# Altium project Kasli.PrjPCB (part 3 of 6)

## Sheet PowerSupplies.SchDoc: =ProjectName
size 420 x 297 mm; Author: Paweł Kulik; CompanyName: WUT; DrawnBy: Paweł Kulik; Organization: WUT ISE; Address1: Warsaw Univeristy of Technology; Address2: Nowowiejska 15/19; DocumentNumber: 4; Revision: 2.0.1; SheetNumber: 9; SheetTotal: 11; EDA_Number: ARTIQ; Projet: ARTIQ/SINARA; ModifiedBy: -; CheckedDate: -; Title2: PowerSupplies.SchDoc; DivGrp: ISE; Designer: Paweł Kulik; ModifiedDate: -; ProjectName: ARTIQ/SINARA
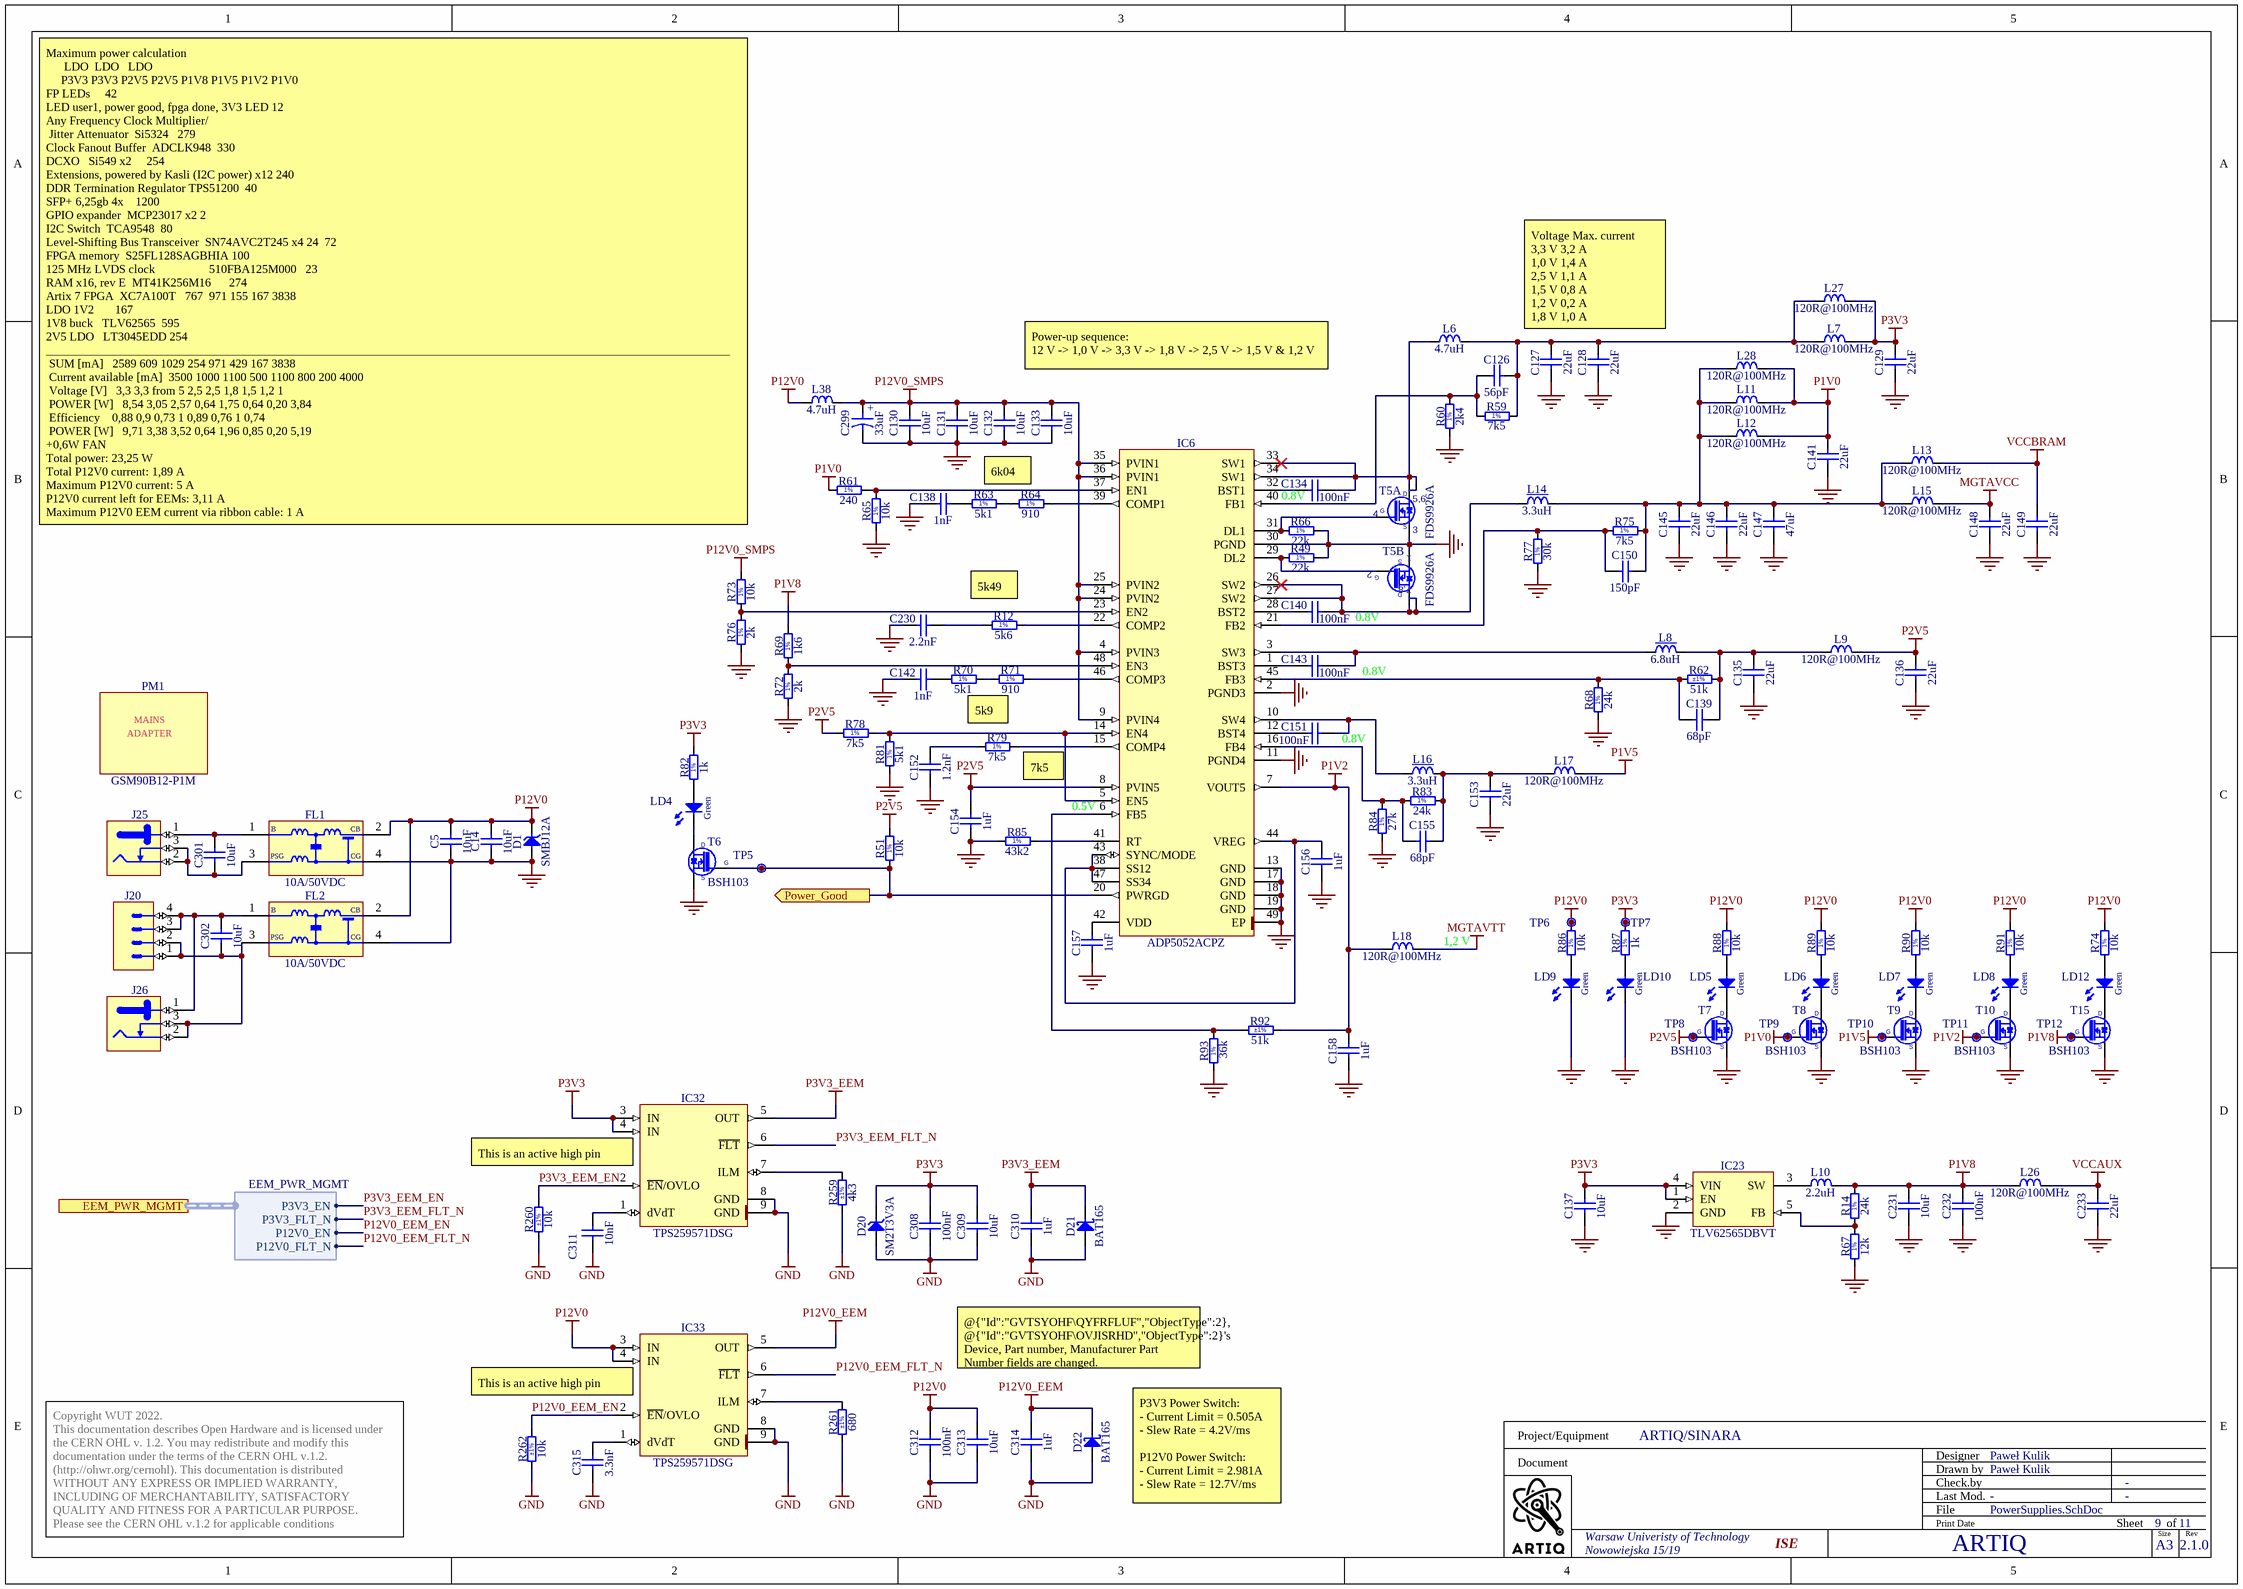
[diagram p3: PowerSupplies.SchDoc]

### Parts
C5  10uF  [CAPC2012X95N]
C14  10uF  [CAPC2012X95N]
C126  56pF  [CAPC1608X87N]
C127  22uF  [CAPC1709X100N]
C128  22uF  [CAPC1709X100N]
C129  22uF  [CAPC1709X100N]
C130  10uF  [CAPC2012X95N]
C131  10uF  [CAPC2012X95N]
C132  10uF  [CAPC2012X95N]
C133  10uF  [CAPC2012X95N]
C134  100nF  [CAPC0603X33N]
C135  22uF  [CAPC1709X100N]
C136  22uF  [CAPC1709X100N]
C137  10uF  [CAPC2012X95N]
C138  1nF  [CAPC1005X55N]
C139  68pF  [CAPC1005X55N]
C140  100nF  [CAPC0603X33N]
C141  22uF  [CAPC1709X100N]
C142  1nF  [CAPC1005X55N]
C143  100nF  [CAPC0603X33N]
C145  22uF  [CAPC1709X100N]
C146  22uF  [CAPC1709X100N]
C147  47uF  [CAPC3225X270N]
C148  22uF  [CAPC1709X100N]
C149  22uF  [CAPC1709X100N]
C150  150pF  [CAPC1005X55N]
C151  100nF  [CAPC0603X33N]
C152  1.2nF  [CAPC1608X87N]
C153  22uF  [CAPC1709X100N]
C154  1uF  [CAPC1005X55N]
C155  68pF  [CAPC1005X55N]
C156  1uF  [CAPC1005X55N]
C157  1uF  [CAPC1005X55N]
C158  1uF  [CAPC1005X55N]
C230  2.2nF  [CAPC1005X55N]
C231  10uF  [CAPC2012X95N]
C232  100nF  [CAPC0603X33N]
C233  22uF  [CAPC1709X100N]
C299  33uF  [CAPMP3528X210N]
C301  10uF  [CAPC2012X95N]
C302  10uF  [CAPC2012X95N]
C308  100nF  [CAPC1608X87N]
C309  10uF  [CAPC2012X95N]
C310  1uF  [CAPC1608X87N]
C311  10nF  [CAPC1005X55N]
C312  100nF  [CAPC1608X87N]
C313  10uF  [CAPC2012X95N]
C314  1uF  [CAPC1608X87N]
C315  3.3nF  [CAPC1005X55N]
D1  SMBJ12A  [DIOM5336X265N]
D20  SM2T3V3A  [DO-216AA]
D21  BAT165  [SOD2512X110N]
D22  BAT165  [SOD2512X110N]
FL1  10A/50VDC  [FIL_MURATA_BNX02]
FL2  10A/50VDC  [FIL_MURATA_BNX02]
IC6  ADP5052ACPZ  [QFN50P700X700X80-49N-S570]
IC23  TLV62565DBVT  [SOT95P280X145-5N]
IC32  TPS259571DSG  [SON50P200X200X80-9N-R100X170]
IC33  TPS259571DSG  [SON50P200X200X80-9N-R100X170]
J20  Mini-Fit Jr.™  [MOLEX_39-30-0040]  (value not drawn)
J25  Jack  [SWITCHCRAFT_712RA]  (value not drawn)
J26  Jack  [SWITCHCRAFT_712RA]  (value not drawn)
L6  4.7uH  [IND_COOPER_DR74]
L7  120R@100MHz  [INDC1608X65N]
L8  6.8uH  [IND_COILCRAFT_XAL4030]
L9  120R@100MHz  [INDC1608X65N]
L10  2.2uH  [IND_WURTH_WE-PMCI_0806LR]
L11  120R@100MHz  [INDC1608X65N]
L12  120R@100MHz  [INDC1608X65N]
L13  120R@100MHz  [INDC1608X65N]
L14  3.3uH  [INDM5552X200N]
L15  120R@100MHz  [INDC1608X65N]
L16  3.3uH  [IND_WURTH_WE-PD3_S]
L17  120R@100MHz  [INDC1608X65N]
L18  120R@100MHz  [INDC1608X65N]
L26  120R@100MHz  [INDC1608X65N]
L27  120R@100MHz  [INDC1608X65N]
L28  120R@100MHz  [INDC1608X65N]
L38  4.7uH  [IND_COOPER_DR74]
LD4  Green  [LED_KINGBRIGHT_KPH-1608CGCK]
LD5  Green  [LED_KINGBRIGHT_KPH-1608CGCK]
LD6  Green  [LED_KINGBRIGHT_KPH-1608CGCK]
LD7  Green  [LED_KINGBRIGHT_KPH-1608CGCK]
LD8  Green  [LED_KINGBRIGHT_KPH-1608CGCK]
LD9  Green  [LED_KINGBRIGHT_KPH-1608CGCK]
LD10  Green  [LED_KINGBRIGHT_KPH-1608CGCK]
LD12  Green  [LED_KINGBRIGHT_KPH-1608CGCK]
PM1  GSM90B12-P1M  (mechanical)
R12  5k6  [RESC1005X40N]
R14  24k  [RESC1005X40N]
R49  22k  [RESC1005X40N]
R51  10k  [RESC1005X40N]
R59  7k5  [RESC1005X40N]
R60  2k4  [RESC1005X40N]
R61  240  [RESC1005X40N]
R62  51k  Tolerance: ±1%  [RESC1005X40N]
R63  5k1  [RESC1005X40N]
R64  910  [RESC1005X40N]
R65  10k  [RESC1005X40N]
R66  22k  [RESC1005X40N]
R67  12k  [RESC1005X40N]
R68  24k  [RESC1005X40N]
R69  1k6  [RESC1005X40N]
R70  5k1  [RESC1005X40N]
R71  910  [RESC1005X40N]
R72  2k  [RESC1005X40N]
R73  10k  [RESC1005X40N]
R74  10k  [RESC1005X40N]
R75  7k5  [RESC1005X40N]
R76  2k  [RESC1005X40N]
R77  30k  [RESC1005X40N]
R78  7k5  [RESC1005X40N]
R79  7k5  [RESC1005X40N]
R81  5k1  [RESC1005X40N]
R82  1k  [RESC1005X40N]
R83  24k  [RESC1005X40N]
R84  27k  [RESC1005X40N]
R85  43k2  [RESC1005X35N]
R86  10k  [RESC1005X40N]
R87  1k  [RESC1005X40N]
R88  10k  [RESC1005X40N]
R89  10k  [RESC1005X40N]
R90  10k  [RESC1005X40N]
R91  10k  [RESC1005X40N]
R92  51k  Tolerance: ±1%  [RESC1005X40N]
R93  36k  [RESC1005X40N]
R259  4k3  Tolerance: ±1%  [RESC1005X40N]
R260  10k  Tolerance: ±1%  [RESC1005X40N]
R261  680  Tolerance: ±1%  [RESC1005X40N]
R262  10k  Tolerance: ±1%  [RESC1005X40N]
T5  FDS9926A  [SOIC127P600X175-8N]  (parts A,B of 2)
T6  BSH103  [SOT95P230X110-3N]
T7  BSH103  [SOT95P230X110-3N]
T8  BSH103  [SOT95P230X110-3N]
T9  BSH103  [SOT95P230X110-3N]
T10  BSH103  [SOT95P230X110-3N]
T15  BSH103  [SOT95P230X110-3N]
TP5  Power Good  [TPS127]  (value not drawn)
TP6  P12V0  [TPS127]  (value not drawn)
TP7  P3V3  [TPS127]  (value not drawn)
TP8  P2V5  [TPS127]  (value not drawn)
TP9  P1V0  [TPS127]  (value not drawn)
TP10  P1V5  [TPS127]  (value not drawn)
TP11  P1V2  [TPS127]  (value not drawn)
TP12  P1V8  [TPS127]  (value not drawn)

### Ports
EEM_PWR_MGMT (harness EEM_PWR_MGMT), Power_Good (out)

### Harnesses
EEM_PWR_MGMT: P3V3_EN, P12V0_EN, P3V3_FLT_N, P12V0_FLT_N

### Nets
GND: C5.1 C14.1 C127.1 C128.1 C129.1 C130.1 C131.1 C132.1 C133.1 C135.1 C136.1 C137.1 C138.1 C141.1 C142.1 C145.1 C146.1 C147.1 C148.1 C149.1 C152.1 C153.1 C154.1 C156.1 C157.1 C158.1 C230.1 C231.1 C232.1 C233.1 C299.2 C308.1 C309.1 C310.1 C311.1 C312.1 C313.1 C314.1 C315.1 D1.2(A) D20.2(A) D21.2(A) D22.2(A) FL1.4(CG) FL2.4(CG) IC6.2(PGND3) IC6.11(PGND4) IC6.13(GND) IC6.17(GND) IC6.18(GND) IC6.19(GND) IC6.30(PGND) IC6.49(EP) IC23.2(GND) IC32.8(GND) IC32.9(GND) IC33.8(GND) IC33.9(GND) LD9.1(C) LD10.1(C) R49.2 R60.1 R65.1 R66.2 R67.1 R68.1 R72.1 R76.1 R77.1 R81.1 R84.1 R85.1 R93.1 R259.1 R260.1 R261.1 R262.1 T5.1(S) T5.3(S) T6.2(S) T7.2(S) T8.2(S) T9.2(S) T10.2(S) T15.2(S)
MGTAVCC: C148.2 L15.2
MGTAVTT: L18.2
P1V0: C141.2 L11.2 L12.2 L28.2 R61.1 T8.1(G) TP9.1
P1V2: C158.2 IC6.7(VOUT5) L18.1 R92.2 T10.1(G) TP11.1
P1V5: L17.2 T9.1(G) TP10.1
P1V8: C231.2 C232.2 L10.2 L26.1 R14.2 R69.2 T15.1(G) TP12.1
P2V5: C136.2 C154.2 IC6.8(PVIN5) L9.2 R51.2 R78.1 T7.1(G) TP8.1
P3V3: C129.2 C137.2 C308.2 C309.2 D20.1(C) IC23.1(EN) IC23.4(VIN) IC32.3(IN) IC32.4(IN) L7.2 L27.2 R82.2 R87.2 TP7.1
P3V3_EEM: C310.2 D21.1(C) IC32.5(OUT)
P12V0: C5.2 C14.2 C312.2 C313.2 D1.1(C) FL1.2(CB) FL2.2(CB) IC33.3(IN) IC33.4(IN) L38.1 R74.2 R86.2 R88.2 R89.2 R90.2 R91.2 TP6.1
P12V0_EEM: C314.2 D22.1(C) IC33.5(OUT)
P12V0_SMPS: C130.2 C131.2 C132.2 C133.2 C299.1 IC6.4(PVIN3) IC6.9(PVIN4) IC6.24(PVIN2) IC6.25(PVIN2) IC6.35(PVIN1) IC6.36(PVIN1) L38.2 R73.2
VCCAUX: C233.2 L26.2
VCCBRAM: C149.2 L13.2
P3V3_EEM_EN: IC32.2(~{EN}/OVLO) R260.2 ; port EEM_PWR_MGMT.P3V3_EN
P3V3_EEM_FLT_N: IC32.6(~{FLT}) ; port EEM_PWR_MGMT.P3V3_FLT_N
P12V0_EEM_EN: IC33.2(~{EN}/OVLO) R262.2 ; port EEM_PWR_MGMT.P12V0_EN  [project net EEM_PWR_EN]
P12V0_EEM_FLT_N: IC33.6(~{FLT}) ; port EEM_PWR_MGMT.P12V0_FLT_N  [project net EEM_FLT_N]
RESETn: IC6.20(PWRGD) R51.1 T6.1(G) TP5.1 ; port Power_Good
NetC126_1: C126.1 IC6.40(FB1) R59.1 R60.2
NetC126_2: C126.2 C127.2 C128.2 L6.2 L7.1 L27.1 R59.2
NetC134_1: C134.1 IC6.33(SW1) IC6.34(SW1) L6.1 T5.5(D) T5.6(D)
NetC134_2: C134.2 IC6.32(BST1)
NetC135_2: C135.2 C139.2 L8.2 L9.1 R62.2
NetC138_2: C138.2 R63.1
NetC139_1: C139.1 IC6.45(FB3) R62.1 R68.2
NetC140_1: C140.1 IC6.26(SW2) IC6.27(SW2) L14.1 T5.7(D) T5.8(D)
NetC140_2: C140.2 IC6.28(BST2)
NetC142_2: C142.2 R70.1
NetC143_1: C143.1 IC6.3(SW3) L8.1
NetC143_2: C143.2 IC6.1(BST3)
NetC145_2: C145.2 C146.2 C147.2 C150.2 L11.1 L12.1 L13.1 L14.2 L15.1 L28.1 R75.2
NetC150_1: C150.1 IC6.21(FB2) R75.1 R77.2
NetC151_1: C151.1 IC6.10(SW4) L16.1
NetC151_2: C151.2 IC6.12(BST4)
NetC152_2: C152.2 R79.1
NetC153_2: C153.2 C155.2 L16.2 L17.1 R83.2
NetC155_1: C155.1 IC6.16(FB4) R83.1 R84.2
NetC156_2: C156.2 IC6.38(SS12) IC6.43(SYNC/MODE) IC6.44(VREG) IC6.47(SS34)
NetC157_2: C157.2 IC6.42(VDD)
NetC230_2: C230.2 R12.1
NetC301_1: C301.1 FL1.3(PSG) J25.2 J25.3
NetC301_2: C301.2 FL1.1(B) J25.1
NetC302_1: C302.1 FL2.3(PSG) J20.1 J20.2 J26.2 J26.3
NetC302_2: C302.2 FL2.1(B) J20.3 J20.4 J26.1
NetC311_2: C311.2 IC32.1(dVdT)
NetC315_2: C315.2 IC33.1(dVdT)
NetIC6_5: IC6.5(EN5) IC6.14(EN4) R78.2 R81.2
NetIC6_6: IC6.6(FB5) R92.1 R93.2
NetIC6_15: IC6.15(COMP4) R79.2
NetIC6_22: IC6.22(COMP2) R12.2
NetIC6_23: IC6.23(EN2) R73.1 R76.2
NetIC6_29: IC6.29(DL2) R49.1 T5.2(G)
NetIC6_31: IC6.31(DL1) R66.1 T5.4(G)
NetIC6_37: IC6.37(EN1) R61.2 R65.2
NetIC6_39: IC6.39(COMP1) R64.2
NetIC6_41: IC6.41(RT) R85.2
NetIC6_46: IC6.46(COMP3) R71.2
NetIC6_48: IC6.48(EN3) R69.1 R72.2
NetIC23_3: IC23.3(SW) L10.1
NetIC23_5: IC23.5(FB) R14.1 R67.2
NetIC32_7: IC32.7(ILM) R259.2
NetIC33_7: IC33.7(ILM) R261.2
NetLD4_1: LD4.1(C) T6.3(D)
NetLD4_2: LD4.2(A) R82.1
NetLD5_1: LD5.1(C) T7.3(D)
NetLD5_2: LD5.2(A) R88.1
NetLD6_1: LD6.1(C) T8.3(D)
NetLD6_2: LD6.2(A) R89.1
NetLD7_1: LD7.1(C) T9.3(D)
NetLD7_2: LD7.2(A) R90.1
NetLD8_1: LD8.1(C) T10.3(D)
NetLD8_2: LD8.2(A) R91.1
NetLD9_2: LD9.2(A) R86.1
NetLD10_2: LD10.2(A) R87.1
NetLD12_1: LD12.1(C) T15.3(D)
NetLD12_2: LD12.2(A) R74.1
NetR63_2: R63.2 R64.1
NetR70_2: R70.2 R71.1

### Notes on the sheet
- Voltage	Max. current
  3,3 V	3,2 A
  1,0 V	1,4 A
  2,5 V	1,1 A
  1,5 V	0,8 A
  1,2 V	0,2 A
  1,8 V	1,0 A
- Power-up sequence:
  12 V -> 1,0 V -> 3,3 V -> 1,8 V -> 2,5 V -> 1,5 V & 1,2 V
- Maximum power calculation
  LDO		LDO			LDO
  P3V3	P3V3	P2V5	P2V5	P1V8	P1V5	P1V2	P1V0
  FP LEDs					42
  LED user1, power good, fpga done, 3V3 LED	12
  Any Frequency Clock Multiplier/
  Jitter Attenuator 	Si5324			279
  Clock Fanout Buffer		ADCLK948		330
  DCXO			Si549 x2					254
  Extensions, powered by Kasli (I2C power) x12	240
  DDR Termination Regulator	TPS51200		40
  SFP+ 6,25gb 4x				1200
  GPIO expander		MCP23017 x2	2
  I2C Switch		TCA9548		80
  Level-Shifting Bus Transceiver 	SN74AVC2T245 x4	24		72
  FPGA memory		S25FL128SAGBHIA	100
  125 MHz LVDS clock                  510FBA125M000			23
  RAM x16, rev E		MT41K256M16						274
  Artix 7 FPGA		XC7A100T			767		971	155	167	3838
  LDO 1V2							167
  1V8 buck			TLV62565		595
  2V5 LDO			LT3045EDD	254
  __________________________________________________________________________________________________________________
  SUM [mA]			2589	609	1029	254	971	429	167	3838
  Current available [mA]		3500	1000	1100	500	1100	800	200	4000
  Voltage [V]			3,3	3,3 from 5	2,5	2,5	1,8	1,5	1,2	1
  POWER [W]			8,54	3,05	2,57	0,64	1,75	0,64	0,20	3,84
  Efficiency				0,88	0,9	0,73	1	0,89	0,76	1	0,74
  POWER [W]			9,71	3,38	3,52	0,64	1,96	0,85	0,20	5,19
  +0,6W FAN
  Total power: 23,25 W
  Total P12V0 current: 1,89 A
  Maximum P12V0 current: 5 A
  P12V0 current left for EEMs: 3,11 A
  Maximum P12V0 EEM current via ribbon cable: 1 A
- 6k04
- (near C134) 0.8V
- (near R12) 5k49
- (near T5) 0.8V
- 5k9
- (near C143) 0.8V
- (near R79) 7k5
- (near C151) 0.8V
- (near IC6) 0.5V
- (near L18) 1,2 V
- (near IC32) This is an active high pin
- (near IC33) This is an active high pin
- @{"Id":"GVTSYOHF\QYFRFLUF","ObjectType":2}, @{"Id":"GVTSYOHF\OVJISRHD","ObjectType":2}'s Device, Part number, Manufacturer Part Number fields are changed.
  This symbol needs updating.
- (near D22) P3V3 Power Switch:
  - Current Limit = 0.505A
  - Slew Rate = 4.2V/ms
  P12V0 Power Switch:
  - Current Limit = 2.981A
  - Slew Rate = 12.7V/ms
- Project/Equipment
- Document
- Designer
- Drawn by
- Check.by
- Copyright WUT 2022.
  This documentation describes Open Hardware and is licensed under the CERN OHL v. 1.2. You may redistribute and modify this documentation under the terms of the CERN OHL v.1.2. (http://ohwr.org/cernohl). This documentation is distributed WITHOUT ANY EXPRESS OR IMPLIED WARRANTY, INCLUDING OF MERCHANTABILITY, SATISFACTORY QUALITY AND FITNESS FOR A PARTICULAR PURPOSE. Please see the CERN OHL v.1.2 for applicable conditions
- File
- Last Mod.
- Print Date
- Sheet
- Size
- A3
- of
- Rev
- (in symbol 43k2 1% 0402) 1%
- (in symbol CTE3528-21_33UF_16V_10%) +
- (in symbol DC_DC_GSM90B12-P1M) MAINS; ADAPTER
- (in symbol FDS9926A, part A) 5,6
- (in symbol FDS9926A, part B) 7,8
- (in symbol R0402_1K6_1%_0.0625W_100PPM) 1%
- (in symbol R0402_1k_1%_0.0625W_100PPM) 1%
- (in symbol R0402_2K4_1%_0.0625W_100PPM) 1%
- (in symbol R0402_2K_1%_0.0625W_100PPM) 1%
- (in symbol R0402_5K1_1%_0.0625W_100PPM) 1%
- (in symbol R0402_5K6_1%_0.0625W_100PPM) 1%
- (in symbol R0402_7K5_1%_0.0625W_100PPM) 1%
- (in symbol R0402_10K_1%_0.0625W_100PPM) 1%
- (in symbol R0402_10k_1%_0.0625W_100PPM) 1%
- (in symbol R0402_12K_1%_0.0625W_100PPM) 1%
- (in symbol R0402_22K_1%_0.0625W_100PPM) 1%
- (in symbol R0402_24K_1%_0.0625W_100PPM) 1%
- (in symbol R0402_27K_1%_0.0625W_100PPM) 1%
- (in symbol R0402_30K_1%_0.0625W_100PPM) 1%
- (in symbol R0402_36K_1%_0.0625W_100PPM) 1%
- (in symbol R0402_240R_1%_0.0625W_100PPM) 1%
- (in symbol R0402_910R_1%_0.0625W_100PPM) 1%

### Library data of the parts
C5 C14 C130-C133 C137 C231 C301 C302 C309 C313 = CC0805_10UF_25V_10%_X5R: Non-polarised capacitor; Part Description: SMD Multilayer Chip Ceramic Capacitor; Manufacturer: GENERIC; Manufacturer1 Part Number: GRM219R61E106KA12D; Voltage: 25V; TC: X5R; Tolerance: ±10%; Part Number: CC0805_10UF_25V_10%_X5R; Component Kind: Standard; Component Type: Standard; Pin Count: 2; Value: 10uF; Status: Preferred; Manufacturer Part Number: CC0805_10UF_25V_10%_X5R; Case: 0805; Mounted: Yes; Socket: No; SMD: Yes; Sense: No; Manufacturer1 Example: MURATA; Manufacturer1 ComponentHeight: 0.95mm; HelpURL: \\cern.ch\dfs\Applications\Altium\Datasheets\CC0805_X5R_MURATA_GRM.pdf; Author: CERN DEM JLC
  C5 C14 C137 C231 C301 C302 C309 C313: CreateDate: 25.10.2012; LatestRevisionDate: 06.09.2016
  C130-C133: CreateDate: 2012-10-25; LatestRevisionDate: 2016-09-06
C126 = CC0603_56PF_50V_5%_NP0: Non-polarised capacitor; Part Description: SMD Multilayer Chip Ceramic Capacitor; Manufacturer: GENERIC; Manufacturer1 Part Number: 223886715569; Voltage: 50V; TC: C0G/NP0; Tolerance: ±5%; Part Number: CC0603_56PF_50V_5%_NP0; Component Kind: Standard; Component Type: Standard; Pin Count: 2; Value: 56pF; Status: Preferred; Manufacturer Part Number: CC0603_56PF_50V_5%_NP0; Case: 0603; Mounted: Yes; Socket: No; SMD: Yes; Sense: No; Manufacturer1 Example: PHYCOMP; Manufacturer1 ComponentHeight: 0.87mm; HelpURL: \\cern.ch\dfs\Applications\Altium\Datasheets\CC0603_NP0_PHYCOMP.pdf; Author: CERN DEM JLC; CreateDate: 03.12.2007; LatestRevisionDate: 03.12.2007
C127-C129 C135 C136 C141 C145 C146 C148 C149 C153 C233 = CC0603_22UF_6.3V_20%_X5R: Non-polarised capacitor; Part Description: SMD Multilayer Chip Ceramic Capacitor; Manufacturer: GENERIC; Manufacturer1 Part Number: C1608X5R0J226M080AC; Voltage: 6.3V; TC: X5R; Tolerance: ±20%; Part Number: CC0603_22UF_6.3V_20%_X5R; Component Kind: Standard; Component Type: Standard; Pin Count: 2; Value: 22uF; Status: None; Manufacturer Part Number: CC0603_22UF_6.3V_20%_X5R; Case: 0603; Mounted: Yes; Socket: No; SMD: Yes; Sense: No; Manufacturer1 Example: TDK; Manufacturer1 ComponentHeight: 1mm; HelpURL: \\cern.ch\dfs\Applications\Altium\Datasheets\CC0603_X5R_TDK_C.pdf; Author: CERN DEM JLC; CreateDate: 16.12.2013; LatestRevisionDate: 13.09.2016
C134 C140 C143 C151 C232 = CC0201_100NF_6.3V_10%_X5R: Non-polarised capacitor; Part Description: SMD Multilayer Chip Ceramic Capacitor; Manufacturer: GENERIC; Manufacturer1 Part Number: 02016D104KAT2A; Voltage: 6.3V; TC: X5R; Tolerance: ±10%; Part Number: CC0201_100NF_6.3V_10%_X5R; Component Kind: Standard; Component Type: Standard; Pin Count: 2; Value: 100nF; Status: Not Recommended; Manufacturer Part Number: CC0201_100NF_6.3V_10%_X5R; Case: 0201; Mounted: Yes; Socket: No; SMD: Yes; Sense: No; Manufacturer1 Example: AVX; Manufacturer1 ComponentHeight: 0.33mm; HelpURL: \\cern.ch\dfs\Applications\Altium\Datasheets\CC0201_X5R_AVX.pdf; Author: CERN DEM JLC
  C134 C140 C143 C151: CreateDate: 2007-12-03; LatestRevisionDate: 2007-12-03
  C232: CreateDate: 03.12.2007; LatestRevisionDate: 03.12.2007
C138 C142 = CC0402_1NF_50V_10%_X7R: Non-polarised capacitor; Part Description: SMD Multilayer Chip Ceramic Capacitor; Manufacturer: GENERIC; Manufacturer1 Part Number: 223858715623; Voltage: 50V; TC: X7R; Tolerance: ±10%; Part Number: CC0402_1NF_50V_10%_X7R; Component Kind: Standard; Component Type: Standard; Pin Count: 2; Value: 1nF; Status: Not Recommended; Manufacturer Part Number: CC0402_1NF_50V_10%_X7R; Case: 0402; Mounted: Yes; Socket: No; SMD: Yes; Sense: No; Manufacturer1 Example: PHYCOMP; Manufacturer1 ComponentHeight: 0.55mm; HelpURL: \\cern.ch\dfs\Applications\Altium\Datasheets\CC0402_X7R_PHYCOMP.pdf; Author: CERN DEM JLC; CreateDate: 03.12.2007; LatestRevisionDate: 03.12.2007
C139 C155 = CC0402_68PF_50V_5%_C0G: Non-polarised capacitor; Part Description: SMD Multilayer Chip Ceramic Capacitor; Manufacturer: GENERIC; Manufacturer1 Part Number: C0402C680J5GACTU; Voltage: 50V; TC: C0G/NP0; Tolerance: ±5%; Part Number: CC0402_68PF_50V_5%_C0G; Component Kind: Standard; Component Type: Standard; Pin Count: 2; Value: 68pF; Status: Preferred; Manufacturer Part Number: CC0402_68PF_50V_5%_C0G; Case: 0402; Mounted: Yes; Socket: No; SMD: Yes; Sense: No; Manufacturer1 Example: KEMET; Manufacturer1 ComponentHeight: 0.55mm; HelpURL: \\cern.ch\dfs\Applications\Altium\Datasheets\CC0805_C0G_KEMET_(Commercial Grade).pdf; Author: CERN DEM JLC; CreateDate: 03.12.2007; LatestRevisionDate: 22.04.2015
C147 = CC1210_47UF_10V_10%_X7R: Non-polarised capacitor; Part Description: SMD Multilayer Chip Ceramic Capacitor; Manufacturer: GENERIC; Manufacturer1 Part Number: GRM32ER71A476KE15; Voltage: 10V; TC: X7R; Tolerance: ±10%; Part Number: CC1210_47UF_10V_10%_X7R; Component Kind: Standard; Component Type: Standard; Pin Count: 2; Value: 47uF; Status: None; Manufacturer Part Number: CC1210_47UF_10V_10%_X7R; Case: 1210; Mounted: Yes; Socket: No; SMD: Yes; Sense: No; Manufacturer1 Example: MURATA; Manufacturer1 ComponentHeight: 2.7mm; HelpURL: \\cern.ch\dfs\Applications\Altium\Datasheets\CC1210_X7R_MURATA.pdf; Author: CERN DEM BC; CreateDate: 18.11.2015; LatestRevisionDate: 18.11.2015
C150 = CC0402_150PF_50V_5%_C0G: Non-polarised capacitor; Part Description: SMD Multilayer Chip Ceramic Capacitor; Manufacturer: GENERIC; Manufacturer1 Part Number: C0402C151J5GACTU; Voltage: 50V; TC: C0G/NP0; Tolerance: ±5%; Part Number: CC0402_150PF_50V_5%_C0G; Component Kind: Standard; Component Type: Standard; Pin Count: 2; Value: 150pF; Status: Preferred; Manufacturer Part Number: CC0402_150PF_50V_5%_C0G; Case: 0402; Mounted: Yes; Socket: No; SMD: Yes; Sense: No; Manufacturer1 Example: KEMET; Manufacturer1 ComponentHeight: 0.55mm; HelpURL: \\cern.ch\dfs\Applications\Altium\Datasheets\CC0805_C0G_KEMET_(Commercial Grade).pdf; Author: CERN DEM JLC; CreateDate: 03.12.2007; LatestRevisionDate: 22.04.2015
C152 = CC0603_1.2NF_50V_10%_X7R: Non-polarised capacitor; Part Description: SMD Multilayer Chip Ceramic Capacitor; Manufacturer: GENERIC; Manufacturer1 Part Number: 223858615624; Voltage: 50V; TC: X7R; Tolerance: ±10%; Part Number: CC0603_1.2NF_50V_10%_X7R; Component Kind: Standard; Component Type: Standard; Pin Count: 2; Value: 1.2nF; Status: Preferred; Manufacturer Part Number: CC0603_1.2NF_50V_10%_X7R; Case: 0603; Mounted: Yes; Socket: No; SMD: Yes; Sense: No; Manufacturer1 Example: PHYCOMP; Manufacturer1 ComponentHeight: 0.87mm; HelpURL: \\cern.ch\dfs\Applications\Altium\Datasheets\CC0603_X7R_PHYCOMP.pdf; Author: CERN DEM JLC; CreateDate: 03.12.2007; LatestRevisionDate: 03.12.2007
C154 C156-C158 = CC0402_1UF_16V_10%_X5R: Non-polarised capacitor; Part Description: SMD Multilayer Chip Ceramic Capacitor; Manufacturer: GENERIC; Manufacturer1 Part Number: C1005X5R1C105KT; Voltage: 16V; TC: X5R; Tolerance: ±10%; Part Number: CC0402_1UF_16V_10%_X5R; Component Kind: Standard; Component Type: Standard; Pin Count: 2; Value: 1uF; Status: Preferred; Manufacturer Part Number: CC0402_1UF_16V_10%_X5R; Case: 0402; Mounted: Yes; Socket: No; SMD: Yes; Sense: No; Manufacturer1 Example: TDK; Manufacturer1 ComponentHeight: 0.55mm; HelpURL: \\cern.ch\dfs\Applications\Altium\Datasheets\CC0402_X5R_TDK_C.pdf; Author: CERN DEM JLC; CreateDate: 2012-10-25; LatestRevisionDate: 2012-10-25
C230 = CC0402_2.2NF_50V_10%_X7R: Non-polarised capacitor; Part Description: SMD Multilayer Chip Ceramic Capacitor; Manufacturer: GENERIC; Manufacturer1 Part Number: 223858715627; Voltage: 50V; TC: X7R; Tolerance: ±10%; Part Number: CC0402_2.2NF_50V_10%_X7R; Component Kind: Standard; Component Type: Standard; Pin Count: 2; Value: 2.2nF; Status: Not Recommended; Manufacturer Part Number: CC0402_2.2NF_50V_10%_X7R; Case: 0402; Mounted: Yes; Socket: No; SMD: Yes; Sense: No; Manufacturer1 Example: PHYCOMP; Manufacturer1 ComponentHeight: 0.55mm; HelpURL: \\cern.ch\dfs\Applications\Altium\Datasheets\CC0402_X7R_PHYCOMP.pdf; Author: CERN DEM JLC; CreateDate: 03.12.2007; LatestRevisionDate: 03.12.2007
C299 = CTE3528-21_33UF_16V_10%: Polarised capacitor; Part Description: Solid Tantalum Chip Capacitor; Manufacturer: GENERIC; Manufacturer1 Part Number: TAJB336K016R; Voltage: 16V; Tolerance: ±10%; Part Number: CTE3528-21_33UF_16V_10%; Component Kind: Standard; Component Type: Standard; Pin Count: 2; Value: 33uF; Status: Preferred; Manufacturer Part Number: CTE3528-21_33UF_16V_10%; Case: B; Mounted: Yes; Socket: No; SMD: Yes; Sense: No; HelpURL: \\cern.ch\dfs\Applications\Altium\Datasheets\CTE_AVX_TAJ.pdf; Author: CERN DEM JLC; CreateDate: 03.12.2007; LatestRevisionDate: 03.12.2007; Manufacturer1 Example: AVX; Manufacturer1 ComponentHeight: 2.1mm
C308 C312 = CC0603_100NF_50V_10%_X7R: Non-polarised capacitor; Part Description: SMD Multilayer Chip Ceramic Capacitor; Manufacturer: GENERIC; Manufacturer1 Part Number: 223858615649; Voltage: 50V; TC: X7R; Tolerance: ±10%; Part Number: CC0603_100NF_50V_10%_X7R; Component Kind: Standard; Component Type: Standard; Pin Count: 2; Value: 100nF; Status: Preferred; Manufacturer Part Number: CC0603_100NF_50V_10%_X7R; Case: 0603; Mounted: Yes; Socket: No; SMD: Yes; Sense: No; Manufacturer1 Example: PHYCOMP; Manufacturer1 ComponentHeight: 0.87mm; HelpURL: \\cern.ch\dfs\Applications\Altium\Datasheets\CC0603_X7R_PHYCOMP.pdf; Author: CERN DEM JLC; CreateDate: 12/3/2007; LatestRevisionDate: 12/3/2007
C310 C314 = CC0603_1UF_16V_10%_X7R: Non-polarised capacitor; Part Description: SMD Multilayer Chip Ceramic Capacitor; Manufacturer: GENERIC; Manufacturer1 Part Number: 223878615663; Voltage: 16V; TC: X7R; Tolerance: ±10%; Part Number: CC0603_1UF_16V_10%_X7R; Component Kind: Standard; Component Type: Standard; Pin Count: 2; Value: 1uF; Status: None; Manufacturer Part Number: CC0603_1UF_16V_10%_X7R; Case: 0603; Mounted: Yes; Socket: No; SMD: Yes; Sense: No; Manufacturer1 Example: YAGEO PHYCOMP; Manufacturer1 ComponentHeight: 0.9mm; HelpURL: \\cern.ch\dfs\Applications\Altium\Datasheets\CC0603_X7R_PHYCOMP.pdf; Author: CERN DEM JLC; CreateDate: 12/3/2007; LatestRevisionDate: 4/17/2015
C311 = CC0402_10NF_16V_10%_X7R: Non-polarised capacitor; Part Description: SMD Multilayer Chip Ceramic Capacitor; Manufacturer: GENERIC; Manufacturer1 Part Number: 223878715636; Voltage: 16V; TC: X7R; Tolerance: ±10%; Part Number: CC0402_10NF_16V_10%_X7R; Component Kind: Standard; Component Type: Standard; Pin Count: 2; Value: 10nF; Status: Not Recommended; Manufacturer Part Number: CC0402_10NF_16V_10%_X7R; Case: 0402; Mounted: Yes; Socket: No; SMD: Yes; Sense: No; Manufacturer1 Example: PHYCOMP; Manufacturer1 ComponentHeight: 0.55mm; HelpURL: \\cern.ch\dfs\Applications\Altium\Datasheets\CC0402_X7R_PHYCOMP.pdf; Author: CERN DEM JLC; CreateDate: 03.12.2007; LatestRevisionDate: 03.12.2007
C315 = CC0402_3.3NF_50V_10%_X7R: Non-polarised capacitor; Part Description: SMD Multilayer Chip Ceramic Capacitor; Manufacturer: GENERIC; Manufacturer1 Part Number: 223858715629; Voltage: 50V; TC: X7R; Tolerance: ±10%; Part Number: CC0402_3.3NF_50V_10%_X7R; Component Kind: Standard; Component Type: Standard; Pin Count: 2; Value: 3.3nF; Status: Not Recommended; Manufacturer Part Number: CC0402_3.3NF_50V_10%_X7R; Case: 0402; Mounted: Yes; Socket: No; SMD: Yes; Sense: No; Manufacturer1 Example: PHYCOMP; Manufacturer1 ComponentHeight: 0.55mm; HelpURL: \\cern.ch\dfs\Applications\Altium\Datasheets\CC0402_X7R_PHYCOMP.pdf; Author: CERN DEM JLC; CreateDate: 12/3/2007; LatestRevisionDate: 12/3/2007
D1 = SMBJ12A: Zener Diode; Part Description: Uni-Directional Transient Voltage Suppressor Diode; Manufacturer: FAIRCHILD SEMICONDUCTOR; Voltage: 12V; Power: 600W; PressFit: No; Bonding: No; Part Number: SMBJ12A; Component Kind: Standard; Component Type: Standard; Device: SMBJ12A; PackageDescription: DO-214-AA/SMB Diode, Molded Body; 5.34mm L X 3.625mm W X 2.65mm H, IPC Medium Density; Manufacturer Part Number: SMBJ12A; Pin Count: 2; Case: DO-214AA; Mounted: Yes; Socket: No; SMD: Yes; Sense: No; ComponentHeight: 2.65mm; HelpURL: \\cern.ch\dfs\Applications\Altium\Datasheets\SMBJ.pdf; Author: CERN DEM JLC; CreateDate: 10.04.2013; LatestRevisionDate: 10.04.2013
D20 = SM2T3V3A: Transient Voltage Suppressor Diode (Uni-Directional); Part Description: Low voltage Unidirectional Transil™ Diode; Manufacturer: ST MICROELECTRONICS; Voltage: 3V3; Power: 200W; PressFit: No; Bonding: No; Part Number: SM2T3V3A; Component Kind: Standard; Component Type: Standard; Device: SM2T3V3A; PackageDescription: DO-216-AA/SMB Molded Diode, Body 1.9x1.9mm, IPC Medium Density; Manufacturer Part Number: SM2T3V3A; Pin Count: 2; Case: DO-216AA; Mounted: Yes; Socket: No; SMD: Yes; Sense: No; ComponentHeight: 1.15mm; HelpURL: \\cern.ch\dfs\Applications\Altium\Datasheets\SM2T3V3A.pdf; Author: CERN DEM BR; CreateDate: 6/27/2019; LatestRevisionDate: 6/27/2019
D21 D22 = BAT165: Schottky Diode; Part Description: Medium Power AF Schottky Diode; Manufacturer: INFINEON; Voltage: 40V; Power: 750mA; PressFit: No; Bonding: No; Part Number: BAT165; Component Kind: Standard; Component Type: Standard; Device: BAT165; PackageDescription: Small Outline Diode (SOD-323), 1.70mm W X 1.25mm L X 1.10mm H body,  IPC Medium Density; Manufacturer Part Number: BAT165; Pin Count: 2; Case: SOD323; Mounted: Yes; Socket: No; SMD: Yes; Sense: No; ComponentHeight: 1.1mm; HelpURL: \\cern.ch\dfs\Applications\Altium\Datasheets\BAT165.pdf; Author: CERN DEM JLC; CreateDate: 12.11.2014; LatestRevisionDate: 12.11.2014
FL1 FL2 = FIL_MURATA_BNX022-01L: Block Type EMIFIL (LC Combined); Part Description: Block Type EMIFIL (LC Combined) SMD Type, BNX02* Series; Manufacturer: MURATA; Resistance: 0.5R; Part Number: FIL_MURATA_BNX022-01L; Component Kind: Standard; Component Type: Standard; Pin Count: 2; Value: 10A/50VDC; Status: None; Manufacturer Part Number: BNX022-01L; Mounted: Yes; Socket: No; SMD: Yes; Sense: No; ComponentHeight: 3.3mm; HelpURL: \\cern.ch\dfs\Applications\Altium\Datasheets\FIL_MURATA_BNX022-01L.pdf; Author: CERN DEM JLC; CreateDate: 10.10.2012; LatestRevisionDate: 10.10.2012
IC6 = ADP5052ACPZ: 5-Channel Integrated Power Solution with Quad buck Regulators and 200mA LDO Regulator; Manufacturer: ANALOG DEVICES; PressFit: No; Bonding: No; Part Number: ADP5052ACPZ; Component Kind: Standard; Component Type: Standard; Device: ADP5052ACPZ; PackageDescription: QFN, 0.50mm pitch,square; 12 pin X 12 pin, 7mm X 7mm X 0.8mm H body (w/thermal tab 5.70 X 5.70mm),  IPC Medium Density; Part Description: 5-Channel Integrated Power Solution with Quad buck Regulators and 200mA LDO Regulator; Manufacturer Part Number: ADP5052ACPZ; Pin Count: 49; Case: QFN48; Mounted: Yes; Socket: No; SMD: Yes; Sense: No; ComponentHeight: 0.8mm; HelpURL: \\cern.ch\dfs\Applications\Altium\Datasheets\ADP5052ACPZ.pdf; Author: CERN DEM BC; CreateDate: 2015-07-30; LatestRevisionDate: 2015-07-30
IC23 = TLV62565DBVT: 1.5A High Efficiency Step-Down Converter, Adjustable Output Voltage; Manufacturer: TEXAS INSTRUMENTS; PressFit: No; Bonding: No; Part Number: TLV62565DBVT; Component Kind: Standard; Component Type: Standard; Device: TLV62565DBVT; PackageDescription: SOT, 0.95mm Pitch; 5 Pin, 1.60mm W X 2.90mm L X 1.45mm H Body, IPC Medium Density; Part Description: 1.5A High Efficiency Step-Down Converter, Adjustable Output Voltage; Manufacturer Part Number: TLV62565DBVT; Pin Count: 5; Case: SOT23-5; Mounted: Yes; Socket: No; SMD: Yes; Sense: No; ComponentHeight: 1.45mm; HelpURL: \\cern.ch\dfs\Applications\Altium\Datasheets\TLV62565DBVT.pdf; Author: CERN DEM JMW; CreateDate: 29.08.2016; LatestRevisionDate: 29.08.2016
IC32 IC33 = TPS259573DSGR: 2.7V to 18V, 4A, 34-mOhm eFuse With Fast Programmable Overvoltage Protection; Part Description: 2.7V to 18V, 4A, 34-mOhm eFuse with Fast Overvoltage Protection; Manufacturer: TEXAS INSTRUMENTS; PressFit: No; Bonding: No; Part Number: TPS259571DSG; Component Kind: Standard; Component Type: Standard; Device: TPS259571DSG; PackageDescription: SON, 0.50mm Pitch; 8 Pin, 2.00mm W X 2.00mm L X 0.80mm H body (w/Thermal Tab 1.00 X 1.70mm), IPC Medium Density; Manufacturer Part Number: TPS259571DSG; Pin Count: 9; Case: SON8; Mounted: Yes; Socket: No; SMD: Yes; Sense: No; ComponentHeight: 0.8mm; Author: CERN DEM JLC; HelpURL: \\cern.ch\dfs\Applications\Altium\Datasheets\TPS259573DSGR.pdf; CreateDate: 1/16/2019; LatestRevisionDate: 6/13/2022
J20 = MOLEX_39-30-0040: Connector 4 Male; Part Description: 4.20mm (.165") Pitch Mini-Fit Jr. Header, Dual Row, Right Angle with Snap-in Plastic Peg PCB Lock, 4 Circuits; Manufacturer: MOLEX; PressFit: No; Part Number: MOLEX_39-30-0040; Component Kind: Standard; Component Type: Standard; Pin Count: 4; Family: Mini-Fit Jr.™; Mounted: Yes; Socket: No; SMD: No; Sense: No; Status: None; Manufacturer Part Number: 39-30-0040; ComponentHeight: 11.4mm; HelpURL: \\cern.ch\dfs\Applications\Altium\Datasheets\MOLEX_39-30-0040.pdf; Author: CERN DEM JLC; CreateDate: 2018-10-02; LatestRevisionDate: 2018-10-02
J25 J26 = SWITCHCRAFT_712RA: 2.5 mm Center Pin, 5A, 48V, Right Angle, Through Hole, , DC Power Jack Connector; Part Description: 2.5 mm Center Pin, 5A, 48VDC, Right Angle, Through Hole, Locking Power Jack Connector (Threaded Bushings); Manufacturer Part Number: 712RA; PressFit: No; Part Number: SWITCHCRAFT_712RA; Component Kind: Standard; Component Type: Standard; Pin Count: 3; Family: Jack; Mounted: Yes; Socket: No; SMD: No; Sense: No; Status: None; Manufacturer: SWITCHCRAFT; ComponentHeight: 13.8mm; HelpURL: \\cern.ch\dfs\Applications\Altium\Datasheets\SWITCHCRAFT_712RA.pdf; Author: CERN DEM JLC; CreateDate: 2017-12-19; LatestRevisionDate: 2017-12-19
L6 L38 = IND_4.7UH_20%_COOPER_DR74-4R7-R: Inductor; Part Description: High Power Density, High Efficiency, Shielded Drum Core Power Inductor; Manufacturer: COOPER INDUSTRIES / EATON; Power: 3.34A; Resistance: 0.0254R; Tolerance: ±20%; Part Number: IND_4.7UH_20%_COOPER_DR74-4R7-R; Component Kind: Standard; Component Type: Standard; Pin Count: 2; Value: 4.7uH; Status: None; Manufacturer Part Number: DR74-4R7-R; Mounted: Yes; Socket: No; SMD: Yes; Sense: No; ComponentHeight: 4.35mm; HelpURL: \\cern.ch\dfs\Applications\Altium\Datasheets\IND_COOPER_DR74.pdf; Author: CERN DEM JLC; CreateDate: 2017-11-23; LatestRevisionDate: 2017-11-23
L7 L9 L11-L13 L15 L17 L18 L26-L28 = IND0603_MURATA_BLM18SG121TN1D: Inductor; Part Description: SMD EMIFIL Suppression Chip Ferrite Bead; Manufacturer: MURATA; Power: 3A; Resistance: 0.025R; Tolerance: ±25%; Part Number: IND0603_MURATA_BLM18SG121TN1D; Component Kind: Standard; Component Type: Standard; Pin Count: 2; Value: 120R@100MHz; Status: None; Manufacturer Part Number: BLM18SG121TN1D; Case: 0603; Mounted: Yes; Socket: No; SMD: Yes; Sense: No; ComponentHeight: 0.65mm; HelpURL: \\cern.ch\dfs\Applications\Altium\Datasheets\IND0603_MURATA_BLM18S.pdf; Author: CERN DEM JLC; CreateDate: 23.07.2014; LatestRevisionDate: 23.07.2014
L8 = IND_6.8UH_20%_COILCRAFT_XAL4030: Inductor With Core; Part Description: SMD Shielded Power Inductor; Manufacturer Part Number: XAL4030-682MEB; Power: 3A; Resistance: 0.0741R; Tolerance: ±20%; Part Number: IND_6.8UH_20%_COILCRAFT_XAL4030; Component Kind: Standard; Component Type: Standard; Pin Count: 2; Value: 6.8uH; Status: None; Manufacturer: COILCRAFT; Mounted: Yes; Socket: No; SMD: Yes; Sense: No; ComponentHeight: 2.1mm; HelpURL: \\cern.ch\dfs\Applications\Altium\Datasheets\IND_COILCRAFT_XAL4030.pdf; Author: CERN DEM MR; CreateDate: 14.03.2016; LatestRevisionDate: 14.03.2016
L10 = IND_2.2UH_20%_WURTH_WE-PMCI_74479276222C: Inductor; Part Description: SMD Power Molded Chip  Inductor (WE-PMCI Series); Manufacturer: WURTH ELEKTRONIK; Power: 1.1A; Resistance: 0.112R; Tolerance: ±20%; Part Number: IND_2.2UH_20%_WURTH_WE-PMCI_74479276222C; Component Kind: Standard; Component Type: Standard; Pin Count: 2; Value: 2.2uH; Status: None; Manufacturer Part Number: 74479276222C; Case: 0806; Mounted: Yes; Socket: No; SMD: Yes; Sense: No; ComponentHeight: 1mm; HelpURL: \\cern.ch\dfs\Applications\Altium\Datasheets\IND_WURTH_WE-PMCI_74479276222C.pdf; Author: CERN DEM JLC; CreateDate: 20.10.2016; LatestRevisionDate: 20.10.2016
L14 = IND2020_3.3UH_20%_VISHAY_IHLP-2020BZ-11: Inductor With Core; Manufacturer: VISHAY DALE; Part Description: Low Profile, High Current IHLP® Inductor; Manufacturer Part Number: IHLP2020BZER3R3M11; Power: 4.1A; Tolerance: ±20%; Resistance: 0.0578R; Value: 3.3uH; HelpURL: \\cern.ch\dfs\Applications\Altium\Datasheets\IND2020_VISHAY_IHLP2020BZ-11.pdf; Part Number: IND2020_3.3UH_20%_VISHAY_IHLP-2020BZ-11; Component Kind: Standard; Component Type: Standard; Pin Count: 2; Status: None; Case: 2020; Mounted: Yes; Socket: No; SMD: Yes; Sense: No; ComponentHeight: 2mm; Author: CERN DEM MR; CreateDate: 04.12.2017; LatestRevisionDate: 04.12.2017
L16 = IND_3.3UH_20%_WURTH_WE-PD3_74451033: Inductor With Core; Part Description: Shielded Power Inductor (WE-PD 3 Series); Manufacturer: WURTH ELEKTRONIK; Power: 1.6A; Resistance: 0.025R; Tolerance: ±20%; Part Number: IND_3.3UH_20%_WURTH_WE-PD3_74451033; Component Kind: Standard; Component Type: Standard; Pin Count: 2; Value: 3.3uH; Status: None; Manufacturer Part Number: 74451033; Mounted: Yes; Socket: No; SMD: Yes; Sense: No; ComponentHeight: 2.92mm; HelpURL: \\cern.ch\dfs\Applications\Altium\Datasheets\IND_WURTH_WE-PD3_74451033.pdf; Author: CERN DEM JLC; CreateDate: 11.05.2010; LatestRevisionDate: 15.09.2014
LD4-LD10 LD12 = LED_KINGBRIGHT_KPH-1608CGCK: LED Green 1C 2A; Part Description: SMD Green LED, Case 1.6mmX0.8mm(0603), 0.65mm Thickness; PressFit: No; Bonding: No; Manufacturer Part Number: KPH-1608CGCK; ComponentHeight: 0.65mm; HelpURL: \\cern.ch\dfs\Applications\Altium\Datasheets\LED_KINGBRIGHT_KPH-1608CGCK.pdf; Part Number: LED_KINGBRIGHT_KPH-1608CGCK; Component Kind: Standard; Component Type: Standard; Color: Green; PackageDescription: SMT Green LED, Case 0603, Body L 1.6 x W 0.8mm H 0.65mm; Manufacturer: KINGBRIGHT; Pin Count: 2; Mounted: Yes; Socket: No; SMD: Yes; Sense: No; Author: CERN DEM JLC; CreateDate: 03.07.2017; LatestRevisionDate: 03.07.2017
PM1 = DC_DC_GSM90B12-P1M: 90W  AC-DC  Medical Power Adaptor; Part Description: 80-264VAC To 12VDC (6.67A) 90W Power Supply; Manufacturer: MEAN WELL; PressFit: No; Bonding: No; Part Number: GSM90B12-P1M; Component Type: Standard; Device: GSM90B12-P1M; Footprint: DC_DC_GSM90B12-P1M; PackageDescription: GSM Series, 145.0mm x 60.0mm x 32.0mm , Power Supply; Status: None; Manufacturer Part Number: GSM90B12-P1M; Pin Count: 0; Mounted: Yes; Socket: No; SMD: No; Sense: No; ComponentHeight: 21.5mm; HelpURL: \\cern.ch\dfs\Applications\Altium\Datasheets\IRM-10-12.pdf; Author: GK; CreateDate: 14.02.2018; LatestRevisionDate: 14.02.2018
R12 = R0402_5K6_1%_0.0625W_100PPM: Resistor - 1%; Part Description: General Purpose Thick Film Chip Resistor; Manufacturer: GENERIC; Manufacturer1 Part Number: 232270675602L; TC: ±100ppm/°C; PressFit: No; Part Number: R0402_5K6_1%_0.0625W_100PPM; Component Kind: Standard; Component Type: Standard; Pin Count: 2; Value: 5k6; Status: Not Recommended; Power: 0.0625W; Tolerance: ±1%; Manufacturer Part Number: R0402_5K6_1%_0.0625W_100PPM; Case: 0402; Mounted: Yes; Sense: No; Socket: No; SMD: Yes; Manufacturer1 Example: YAGEO PHYCOMP; Manufacturer1 ComponentHeight: 0.4mm; HelpURL: \\cern.ch\dfs\Applications\Altium\Datasheets\R0402_Phycomp_RC0402.pdf; Author: CERN DEM JLC; CreateDate: 03.12.2007; LatestRevisionDate: 17.10.2012
R14 R68 R83 = R0402_24K_1%_0.0625W_100PPM: Resistor - 1%; Part Description: General Purpose Thick Film Chip Resistor; Manufacturer: GENERIC; Manufacturer1 Part Number: 232270672403L; TC: ±100ppm/°C; PressFit: No; Part Number: R0402_24K_1%_0.0625W_100PPM; Component Kind: Standard; Component Type: Standard; Pin Count: 2; Value: 24k; Status: Not Recommended; Power: 0.0625W; Tolerance: ±1%; Manufacturer Part Number: R0402_24K_1%_0.0625W_100PPM; Case: 0402; Mounted: Yes; Sense: No; Socket: No; SMD: Yes; Manufacturer1 Example: YAGEO PHYCOMP; Manufacturer1 ComponentHeight: 0.4mm; HelpURL: \\cern.ch\dfs\Applications\Altium\Datasheets\R0402_Phycomp_RC0402.pdf; Author: CERN DEM JLC; CreateDate: 03.12.2007; LatestRevisionDate: 17.10.2012
R49 R66 = R0402_22K_1%_0.0625W_100PPM: Resistor - 1%; Part Description: General Purpose Thick Film Chip Resistor; Manufacturer: GENERIC; Manufacturer1 Part Number: 232270672203L; TC: ±100ppm/°C; PressFit: No; Part Number: R0402_22K_1%_0.0625W_100PPM; Component Kind: Standard; Component Type: Standard; Pin Count: 2; Value: 22k; Status: Not Recommended; Power: 0.0625W; Tolerance: ±1%; Manufacturer Part Number: R0402_22K_1%_0.0625W_100PPM; Case: 0402; Mounted: Yes; Sense: No; Socket: No; SMD: Yes; Manufacturer1 Example: YAGEO PHYCOMP; Manufacturer1 ComponentHeight: 0.4mm; HelpURL: \\cern.ch\dfs\Applications\Altium\Datasheets\R0402_Phycomp_RC0402.pdf; Author: CERN DEM JLC; CreateDate: 03.12.2007; LatestRevisionDate: 17.10.2012
R51 R65 R73 R260 R262 = R0402_10K_1%_0.0625W_100PPM: Resistor - 1%; Part Description: General Purpose Thick Film Chip Resistor; Manufacturer: GENERIC; Manufacturer1 Part Number: 232270671003L; TC: ±100ppm/°C; PressFit: No; Part Number: R0402_10K_1%_0.0625W_100PPM; Component Kind: Standard; Component Type: Standard; Pin Count: 2; Value: 10k; Status: Not Recommended; Power: 0.0625W; Manufacturer Part Number: R0402_10K_1%_0.0625W_100PPM; Case: 0402; Mounted: Yes; Sense: No; Socket: No; SMD: Yes; Manufacturer1 Example: YAGEO PHYCOMP; Manufacturer1 ComponentHeight: 0.4mm; HelpURL: \\cern.ch\dfs\Applications\Altium\Datasheets\R0402_Phycomp_RC0402.pdf; Author: CERN DEM JLC
  R51 R73: Tolerance: ±1%; CreateDate: 03.12.2007; LatestRevisionDate: 17.10.2012
  R65: Tolerance: ±1%; CreateDate: 2007-12-03; LatestRevisionDate: 2012-10-17
  R260 R262: CreateDate: 12/3/2007; LatestRevisionDate: 10/17/2012
R59 R75 R78 R79 = R0402_7K5_1%_0.0625W_100PPM: Resistor - 1%; Part Description: General Purpose Thick Film Chip Resistor; Manufacturer: GENERIC; Manufacturer1 Part Number: 232270677502L; TC: ±100ppm/°C; PressFit: No; Part Number: R0402_7K5_1%_0.0625W_100PPM; Component Kind: Standard; Component Type: Standard; Pin Count: 2; Value: 7k5; Status: Not Recommended; Power: 0.0625W; Tolerance: ±1%; Manufacturer Part Number: R0402_7K5_1%_0.0625W_100PPM; Case: 0402; Mounted: Yes; Sense: No; Socket: No; SMD: Yes; Manufacturer1 Example: YAGEO PHYCOMP; Manufacturer1 ComponentHeight: 0.4mm; HelpURL: \\cern.ch\dfs\Applications\Altium\Datasheets\R0402_Phycomp_RC0402.pdf; Author: CERN DEM JLC; CreateDate: 03.12.2007; LatestRevisionDate: 17.10.2012
R60 = R0402_2K4_1%_0.0625W_100PPM: Resistor - 1%; Part Description: General Purpose Thick Film Chip Resistor; Manufacturer: GENERIC; Manufacturer1 Part Number: 232270672402L; TC: ±100ppm/°C; PressFit: No; Part Number: R0402_2K4_1%_0.0625W_100PPM; Component Kind: Standard; Component Type: Standard; Pin Count: 2; Value: 2k4; Status: Not Recommended; Power: 0.0625W; Tolerance: ±1%; Manufacturer Part Number: R0402_2K4_1%_0.0625W_100PPM; Case: 0402; Mounted: Yes; Sense: No; Socket: No; SMD: Yes; Manufacturer1 Example: YAGEO PHYCOMP; Manufacturer1 ComponentHeight: 0.4mm; HelpURL: \\cern.ch\dfs\Applications\Altium\Datasheets\R0402_Phycomp_RC0402.pdf; Author: CERN DEM JLC; CreateDate: 03.12.2007; LatestRevisionDate: 17.10.2012
R61 = R0402_240R_1%_0.0625W_100PPM: Resistor - 1%; Part Description: General Purpose Thick Film Chip Resistor; Manufacturer: GENERIC; Manufacturer1 Part Number: 232270672401L; TC: ±100ppm/°C; PressFit: No; Part Number: R0402_240R_1%_0.0625W_100PPM; Component Kind: Standard; Component Type: Standard; Pin Count: 2; Value: 240; Status: Not Recommended; Power: 0.0625W; Tolerance: ±1%; Manufacturer Part Number: R0402_240R_1%_0.0625W_100PPM; Case: 0402; Mounted: Yes; Sense: No; Socket: No; SMD: Yes; Manufacturer1 Example: YAGEO PHYCOMP; Manufacturer1 ComponentHeight: 0.4mm; HelpURL: \\cern.ch\dfs\Applications\Altium\Datasheets\R0402_Phycomp_RC0402.pdf; Author: CERN DEM JLC; CreateDate: 2007-12-03; LatestRevisionDate: 2012-10-17
R62 R92 = R0402_51K_1%_0.0625W_100PPM: Resistor - 1%; Part Description: General Purpose Thick Film Chip Resistor; Manufacturer: GENERIC; Manufacturer1 Part Number: 232270675103L; TC: ±100ppm/°C; PressFit: No; Part Number: R0402_51K_1%_0.0625W_100PPM; Component Kind: Standard; Component Type: Standard; Pin Count: 2; Value: 51k; Status: Not Recommended; Power: 0.0625W; Manufacturer Part Number: R0402_51K_1%_0.0625W_100PPM; Case: 0402; Mounted: Yes; Sense: No; Socket: No; SMD: Yes; Manufacturer1 Example: YAGEO PHYCOMP; Manufacturer1 ComponentHeight: 0.4mm; HelpURL: \\cern.ch\dfs\Applications\Altium\Datasheets\R0402_Phycomp_RC0402.pdf; Author: CERN DEM JLC; CreateDate: 12/3/2007; LatestRevisionDate: 10/17/2012
R63 R70 R81 = R0402_5K1_1%_0.0625W_100PPM: Resistor - 1%; Part Description: General Purpose Thick Film Chip Resistor; Manufacturer: GENERIC; Manufacturer1 Part Number: 232270675102L; TC: ±100ppm/°C; PressFit: No; Part Number: R0402_5K1_1%_0.0625W_100PPM; Component Kind: Standard; Component Type: Standard; Pin Count: 2; Value: 5k1; Status: Not Recommended; Power: 0.0625W; Tolerance: ±1%; Manufacturer Part Number: R0402_5K1_1%_0.0625W_100PPM; Case: 0402; Mounted: Yes; Sense: No; Socket: No; SMD: Yes; Manufacturer1 Example: YAGEO PHYCOMP; Manufacturer1 ComponentHeight: 0.4mm; HelpURL: \\cern.ch\dfs\Applications\Altium\Datasheets\R0402_Phycomp_RC0402.pdf; Author: CERN DEM JLC; CreateDate: 03.12.2007; LatestRevisionDate: 17.10.2012
R64 R71 = R0402_910R_1%_0.0625W_100PPM: Resistor - 1%; Part Description: General Purpose Thick Film Chip Resistor; Manufacturer: GENERIC; Manufacturer1 Part Number: 232270679101L; TC: ±100ppm/°C; PressFit: No; Part Number: R0402_910R_1%_0.0625W_100PPM; Component Kind: Standard; Component Type: Standard; Pin Count: 2; Value: 910; Status: Not Recommended; Power: 0.0625W; Tolerance: ±1%; Manufacturer Part Number: R0402_910R_1%_0.0625W_100PPM; Case: 0402; Mounted: Yes; Sense: No; Socket: No; SMD: Yes; Manufacturer1 Example: YAGEO PHYCOMP; Manufacturer1 ComponentHeight: 0.4mm; HelpURL: \\cern.ch\dfs\Applications\Altium\Datasheets\R0402_Phycomp_RC0402.pdf; Author: CERN DEM JLC; CreateDate: 03.12.2007; LatestRevisionDate: 17.10.2012
R67 = R0402_12K_1%_0.0625W_100PPM: Resistor - 1%; Part Description: General Purpose Thick Film Chip Resistor; Manufacturer: GENERIC; Manufacturer1 Part Number: 232270671203L; TC: ±100ppm/°C; PressFit: No; Part Number: R0402_12K_1%_0.0625W_100PPM; Component Kind: Standard; Component Type: Standard; Pin Count: 2; Value: 12k; Status: Not Recommended; Power: 0.0625W; Tolerance: ±1%; Manufacturer Part Number: R0402_12K_1%_0.0625W_100PPM; Case: 0402; Mounted: Yes; Sense: No; Socket: No; SMD: Yes; Manufacturer1 Example: YAGEO PHYCOMP; Manufacturer1 ComponentHeight: 0.4mm; HelpURL: \\cern.ch\dfs\Applications\Altium\Datasheets\R0402_Phycomp_RC0402.pdf; Author: CERN DEM JLC; CreateDate: 03.12.2007; LatestRevisionDate: 17.10.2012
R69 = R0402_1K6_1%_0.0625W_100PPM: Resistor - 1%; Part Description: General Purpose Thick Film Chip Resistor; Manufacturer: GENERIC; Manufacturer1 Part Number: 232270671602L; TC: ±100ppm/°C; PressFit: No; Part Number: R0402_1K6_1%_0.0625W_100PPM; Component Kind: Standard; Component Type: Standard; Pin Count: 2; Value: 1k6; Status: Not Recommended; Power: 0.0625W; Tolerance: ±1%; Manufacturer Part Number: R0402_1K6_1%_0.0625W_100PPM; Case: 0402; Mounted: Yes; Sense: No; Socket: No; SMD: Yes; Manufacturer1 Example: YAGEO PHYCOMP; Manufacturer1 ComponentHeight: 0.4mm; HelpURL: \\cern.ch\dfs\Applications\Altium\Datasheets\R0402_Phycomp_RC0402.pdf; Author: CERN DEM JLC; CreateDate: 2007-12-03; LatestRevisionDate: 2012-10-17
R72 R76 = R0402_2K_1%_0.0625W_100PPM: Resistor - 1%; Part Description: General Purpose Thick Film Chip Resistor; Manufacturer: GENERIC; Manufacturer1 Part Number: 232270672002L; TC: ±100ppm/°C; PressFit: No; Part Number: R0402_2K_1%_0.0625W_100PPM; Component Kind: Standard; Component Type: Standard; Pin Count: 2; Value: 2k; Status: Not Recommended; Power: 0.0625W; Tolerance: ±1%; Manufacturer Part Number: R0402_2K_1%_0.0625W_100PPM; Case: 0402; Mounted: Yes; Sense: No; Socket: No; SMD: Yes; Manufacturer1 Example: YAGEO PHYCOMP; Manufacturer1 ComponentHeight: 0.4mm; HelpURL: \\cern.ch\dfs\Applications\Altium\Datasheets\R0402_Phycomp_RC0402.pdf; Author: CERN DEM JLC
  R72: CreateDate: 2007-12-03; LatestRevisionDate: 2012-10-17
  R76: CreateDate: 03.12.2007; LatestRevisionDate: 17.10.2012
R74 R86 R88-R91 = R0402_10k_1%_0.0625W_100PPM: Resistor - 1%; Part Description: General Purpose Thick Film Chip Resistor; Manufacturer: GENERIC; Manufacturer1 Part Number: 232270671003L; TC: ±100ppm/°C; PressFit: No; Part Number: R0402_10K_1%_0.0625W_100PPM; Component Kind: Standard; Component Type: Standard; Pin Count: 2; Value: 10k; Status: Not Recommended; Power: 0.0625W; Tolerance: ±1%; Manufacturer Part Number: R0402_10K_1%_0.0625W_100PPM; Case: 0402; Mounted: Yes; Sense: No; Socket: No; SMD: Yes; Manufacturer1 Example: YAGEO PHYCOMP; Manufacturer1 ComponentHeight: 0.4mm; HelpURL: \\cern.ch\dfs\Applications\Altium\Datasheets\R0402_Phycomp_RC0402.pdf; Author: CERN DEM JLC; CreateDate: 03.12.2007; LatestRevisionDate: 17.10.2012
R77 = R0402_30K_1%_0.0625W_100PPM: Resistor - 1%; Part Description: General Purpose Thick Film Chip Resistor; Manufacturer: GENERIC; Manufacturer1 Part Number: 232270673003L; TC: ±100ppm/°C; PressFit: No; Part Number: R0402_30K_1%_0.0625W_100PPM; Component Kind: Standard; Component Type: Standard; Pin Count: 2; Value: 30k; Status: Not Recommended; Power: 0.0625W; Tolerance: ±1%; Manufacturer Part Number: R0402_30K_1%_0.0625W_100PPM; Case: 0402; Mounted: Yes; Sense: No; Socket: No; SMD: Yes; Manufacturer1 Example: YAGEO PHYCOMP; Manufacturer1 ComponentHeight: 0.4mm; HelpURL: \\cern.ch\dfs\Applications\Altium\Datasheets\R0402_Phycomp_RC0402.pdf; Author: CERN DEM JLC; CreateDate: 03.12.2007; LatestRevisionDate: 17.10.2012
R82 R87 = R0402_1k_1%_0.0625W_100PPM: Resistor - 1%; Part Description: General Purpose Thick Film Chip Resistor; Manufacturer: GENERIC; Manufacturer1 Part Number: 232270671002L; TC: ±100ppm/°C; PressFit: No; Part Number: R0402_1K_1%_0.0625W_100PPM; Component Kind: Standard; Component Type: Standard; Pin Count: 2; Value: 1k; Status: Not Recommended; Power: 0.0625W; Tolerance: ±1%; Manufacturer Part Number: R0402_1K_1%_0.0625W_100PPM; Case: 0402; Mounted: Yes; Sense: No; Socket: No; SMD: Yes; Manufacturer1 Example: YAGEO PHYCOMP; Manufacturer1 ComponentHeight: 0.4mm; HelpURL: \\cern.ch\dfs\Applications\Altium\Datasheets\R0402_Phycomp_RC0402.pdf; Author: CERN DEM JLC; CreateDate: 03.12.2007; LatestRevisionDate: 17.10.2012
R84 = R0402_27K_1%_0.0625W_100PPM: Resistor - 1%; Part Description: General Purpose Thick Film Chip Resistor; Manufacturer: GENERIC; Manufacturer1 Part Number: 232270672703L; TC: ±100ppm/°C; PressFit: No; Part Number: R0402_27K_1%_0.0625W_100PPM; Component Kind: Standard; Component Type: Standard; Pin Count: 2; Value: 27k; Status: Not Recommended; Power: 0.0625W; Tolerance: ±1%; Manufacturer Part Number: R0402_27K_1%_0.0625W_100PPM; Case: 0402; Mounted: Yes; Sense: No; Socket: No; SMD: Yes; Manufacturer1 Example: YAGEO PHYCOMP; Manufacturer1 ComponentHeight: 0.4mm; HelpURL: \\cern.ch\dfs\Applications\Altium\Datasheets\R0402_Phycomp_RC0402.pdf; Author: CERN DEM JLC; CreateDate: 03.12.2007; LatestRevisionDate: 17.10.2012
R85 = 43k2 1% 0402: Resistor - 1%; Power: 0.063W; Value: 43k2; Tolerance: ±1%; Case: 0402
R93 = R0402_36K_1%_0.0625W_100PPM: Resistor - 1%; Part Description: General Purpose Thick Film Chip Resistor; Manufacturer: GENERIC; Manufacturer1 Part Number: 232270673603L; TC: ±100ppm/°C; PressFit: No; Part Number: R0402_36K_1%_0.0625W_100PPM; Component Kind: Standard; Component Type: Standard; Pin Count: 2; Value: 36k; Status: Not Recommended; Power: 0.0625W; Tolerance: ±1%; Manufacturer Part Number: R0402_36K_1%_0.0625W_100PPM; Case: 0402; Mounted: Yes; Sense: No; Socket: No; SMD: Yes; Manufacturer1 Example: YAGEO PHYCOMP; Manufacturer1 ComponentHeight: 0.4mm; HelpURL: \\cern.ch\dfs\Applications\Altium\Datasheets\R0402_Phycomp_RC0402.pdf; Author: CERN DEM JLC; CreateDate: 03.12.2007; LatestRevisionDate: 17.10.2012
R259 = R0402_4K3_1%_0.0625W_100PPM: Resistor - 1%; Part Description: General Purpose Thick Film Chip Resistor; Manufacturer: GENERIC; Manufacturer1 Part Number: 232270674302L; TC: ±100ppm/°C; PressFit: No; Part Number: R0402_4K3_1%_0.0625W_100PPM; Component Kind: Standard; Component Type: Standard; Pin Count: 2; Value: 4k3; Status: Not Recommended; Power: 0.0625W; Manufacturer Part Number: R0402_4K3_1%_0.0625W_100PPM; Case: 0402; Mounted: Yes; Sense: No; Socket: No; SMD: Yes; Manufacturer1 Example: YAGEO PHYCOMP; Manufacturer1 ComponentHeight: 0.4mm; HelpURL: \\cern.ch\dfs\Applications\Altium\Datasheets\R0402_Phycomp_RC0402.pdf; Author: CERN DEM JLC; CreateDate: 12/3/2007; LatestRevisionDate: 10/17/2012
R261 = R0402_680R_1%_0.0625W_100PPM: Resistor - 1%; Part Description: General Purpose Thick Film Chip Resistor; Manufacturer: GENERIC; Manufacturer1 Part Number: 232270676801L; TC: ±100ppm/°C; PressFit: No; Part Number: R0402_680R_1%_0.0625W_100PPM; Component Kind: Standard; Component Type: Standard; Pin Count: 2; Value: 680; Status: Not Recommended; Power: 0.0625W; Manufacturer Part Number: R0402_680R_1%_0.0625W_100PPM; Case: 0402; Mounted: Yes; Sense: No; Socket: No; SMD: Yes; Manufacturer1 Example: YAGEO PHYCOMP; Manufacturer1 ComponentHeight: 0.4mm; HelpURL: \\cern.ch\dfs\Applications\Altium\Datasheets\R0402_Phycomp_RC0402.pdf; Author: CERN DEM JLC; CreateDate: 12/3/2007; LatestRevisionDate: 10/17/2012
T5 = FDS9926A: 20V DUAL N-Channel 2.5V Specified PowerTrench MOSFET; Part Description: 20V DUAL N-Channel 2.5V Specified PowerTrench® MOSFET; Manufacturer: FAIRCHILD SEMICONDUCTOR; PressFit: No; Bonding: No; Part Number: FDS9926A; Component Kind: Standard; Component Type: Standard; Device: FDS9926A; PackageDescription: SOIC 8, Pitch 1.27mm - Body 4x5mm, IPC Medium Density; Manufacturer Part Number: FDS9926A; Pin Count: 8; Case: SOIC8; Mounted: Yes; Socket: No; SMD: Yes; Sense: No; ComponentHeight: 1.75mm; HelpURL: \\cern.ch\dfs\Applications\Altium\Datasheets\FDS9926A.pdf; Author: CERN DEM BC; CreateDate: 2015-09-02; LatestRevisionDate: 2015-09-02
T6-T10 T15 = BSH103: N-CHANNEL MOSFET WITH DIODE; Part Description: 30V 850mA N-Channel Enhancement Mode Field-Effect Transistor; Manufacturer: NEXPERIA; PressFit: No; Bonding: No; Part Number: BSH103; Component Kind: Standard; Component Type: Standard; Device: BSH103; PackageDescription: SOT23, 3 pin, Pitch 0.95mm - 1.3mm W X 2.9mm L X 1.1mm H, IPC Medium Density; Manufacturer Part Number: BSH103; Pin Count: 3; Case: SOT23-3; Mounted: Yes; Socket: No; SMD: Yes; Sense: No; ComponentHeight: 1.1mm; HelpURL: \\cern.ch\dfs\Applications\Altium\Datasheets\BSH103.pdf; Author: CERN DEM JLC; CreateDate: 16.03.2010; LatestRevisionDate: 20.06.2017
TP5-TP12 = SMD_PAD_1.27X1.27MM: Test Point; Part Description: 1.27mm x 1.27mm PCB Copper Area (SMD Test Point); Mounted: No; Part Number: SMD_PAD_1.27X1.27MM; Component Kind: Standard (No BOM); Component Type: Standard (No BOM); Pin Count: 1; Family: Test Point; Socket: No; SMD: Yes; Sense: No; Status: None; ComponentHeight: 0mm; HelpURL: Undefined; Author: CERN DEM JLC; CreateDate: 12.01.2008; LatestRevisionDate: 12.01.2008; PackageDescription: 1.27mm x 1.27mm PCB Copper Area (SMD Test Point)